# EAGLE design skips (EAGLE 5.07)
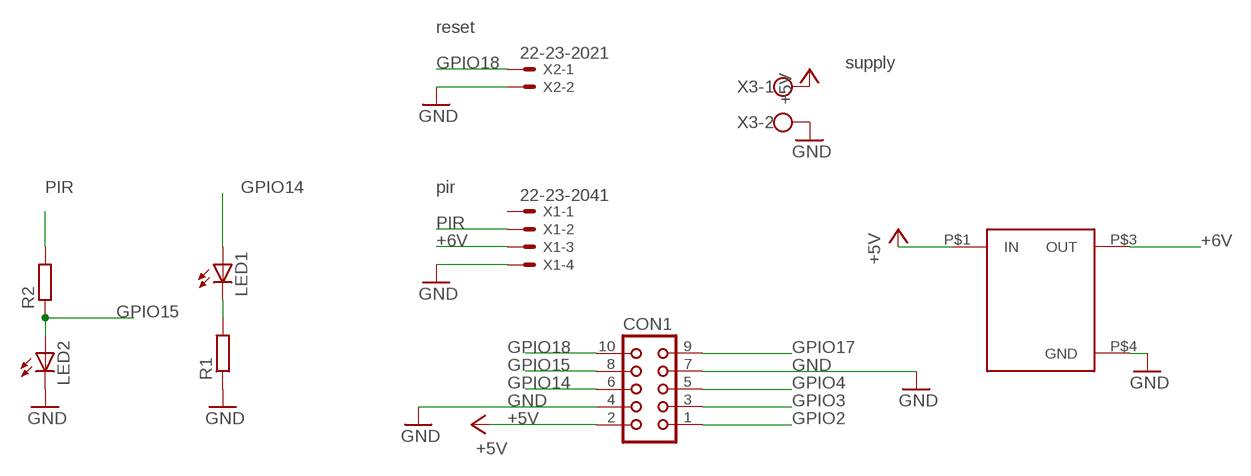
[diagram p0: schematic, sheet 1]

## Parts
CON1  CON10L  [CON10L]
LED1  LED5MM  [LED5MM]
LED2  LED5MM  [LED5MM]
R1  R-EU_0613/15  [P0613/15]
R2  R-EU_0613/15  [P0613/15]
U$1  DCBOOST  [DCBOOST]
X1  22-23-2041  [22-23-2041]
X2  22-23-2021  [22-23-2021]
X3  W237-102  [W237-102]

## Nets
+5V: CON1.2 U$1.P$1(IN) X3.1
+6V: U$1.P$3(OUT) X1.3
GND: CON1.4 CON1.7 LED2.K(C) R1.1 U$1.P$4(GND) X1.4 X2.2 X3.2
GPIO2: CON1.1
GPIO3: CON1.3
GPIO4: CON1.5
GPIO14: CON1.6 LED1.A
GPIO15: CON1.8 LED2.A R2.1
GPIO17: CON1.9
GPIO18: CON1.10 X2.1
N$2: LED1.K(C) R1.2
PIR: R2.2 X1.2
Unconnected: X1.1

## Notes on the sheet
- reset
- supply
- pir

## Library data of the parts
CON1 = con-harting:CON10L: CONNECTOR
LED1 LED2 = matt led:LED: LED OSRAM: - CHIPLED LG R971, LG N971, LY N971, LG Q971, LY Q971, LO R971, LY R971 LH N974, LH R974 LS Q976, LO Q976, LY Q976 LO Q996 - Hyper CHIPLED LW Q18S LB Q993, LB Q99A, LB R99A - SideLED LS A670, LO A670, LY A670, LG A670, LP A670 LB A673, LV A673, LT A673, LW A673 LH A674 LY A675 LS A676, LA A676, LO A676, LY A676, LW A676 LS A679, LY A679, LG A679 - Hyper Micro SIDELED® LS Y876, LA Y876, LO Y876, LY Y876 LT Y87S - SmartLED LW L88C, LW L88S LB L89C, LB L89S, LG L890 LS L89K, LO L89K, LY L89K LS L896, LA L896, LO L896, LY L896 - TOPLED LS T670, LO T670, LY T670, LG T670, LP T670 LSG T670, LSP T670, LSY T670, LOP T670, LYG T670 LG T671, LOG T671, LSG T671 LB T673, LV T673, LT T673, LW T673 LH T674 LS T676, LA T676, LO T676, LY T676, LB T676, LH T676, LSB T676, LW T676 LB T67C, LV T67C, LT T67C, LS T67K, LO T67K, LY T67K, LW E67C LS E67B, LA E67B, LO E67B, LY E67B, LB E67C, LV E67C, LT E67C LW T67C LS T679, LY T679, LG T679 LS T770, LO T770, LY T770, LG T770, LP T770 LB T773, LV T773, LT T773, LW T773 LH T774 LS E675, LA E675, LY E675, LS T675 LS T776, LA T776, LO T776, LY T776, LB T776 LHGB T686 LT T68C, LB T68C - Hyper Mini TOPLED® LB M676 - Mini TOPLED Santana® LG M470 LS M47K, LO M47K, LY M47K Source: http://www.osram.convergy.de LUXEON: - LUMILED® LXK2-PW12-R00, LXK2-PW12-S00, LXK2-PW14-U00, LXK2-PW14-V00 LXK2-PM12-R00, LXK2-PM12-S00, LXK2-PM14-U00 LXK2-PE12-Q00, LXK2-PE12-R00, LXK2-PE12-S00, LXK2-PE14-T00, LXK2-PE14-U00 LXK2-PB12-K00, LXK2-PB12-L00, LXK2-PB12-M00, LXK2-PB14-N00, LXK2-PB14-P00, LXK2-PB14-Q00 LXK2-PR12-L00, LXK2-PR12-M00, LXK2-PR14-Q00, LXK2-PR14-R00 LXK2-PD12-Q00, LXK2-PD12-R00, LXK2-PD12-S00 LXK2-PH12-R00, LXK2-PH12-S00 LXK2-PL12-P00, LXK2-PL12-Q00, LXK2-PL12-R00 Source: www.luxeon.com KINGBRIGHT: KA-3528ASYC Source: www.kingbright.com
R1 R2 = matt rcl:R-EU_: RESISTOR, European symbol
U$1 = matt:DCBOOST
X1 = con-molex:22-23-2041: .100" (2.54mm) Center Header - 4 Pin
X2 = con-molex:22-23-2021: .100" (2.54mm) Center Header - 2 Pin
X3 = con-wago-500:W237-102: WAGO SCREW CLAMP

## Board
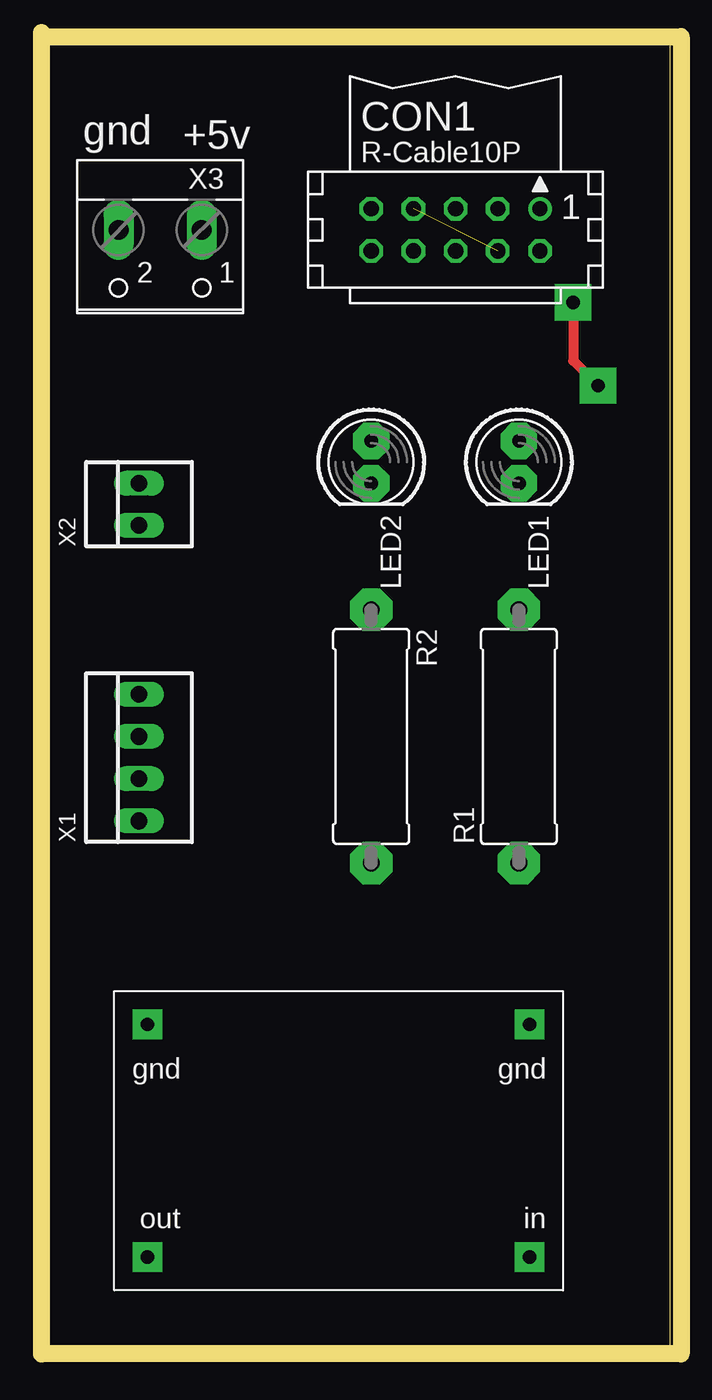
[diagram p1: board, top side]
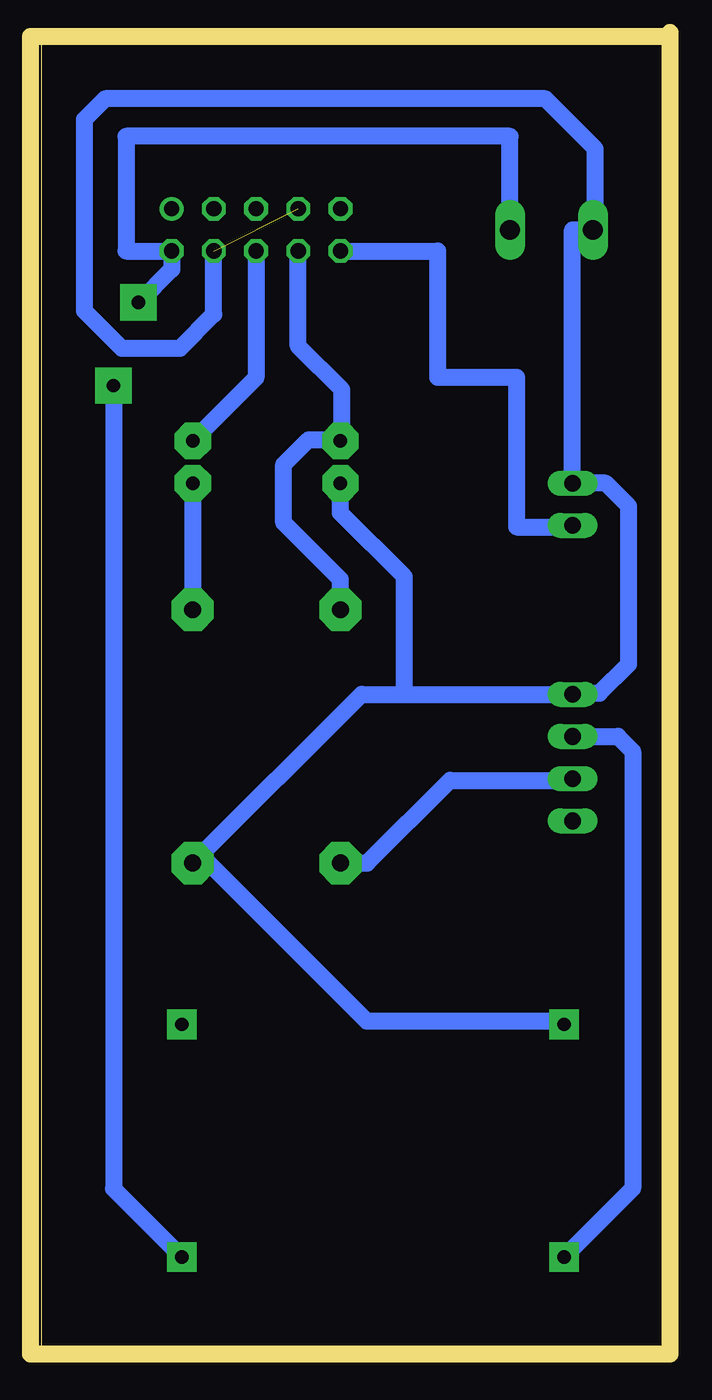
[diagram p2: board, bottom side, seen from below]

Size 37.83 x 79.2 mm. Coordinates in mm from the lower left corner, seen from the top.
Outline: 0,0 37.83,0 37.83,79.2 0,79.2 0,0
Copper layers (1*16): Top 0.035mm / dielectric 1.5mm / Bottom 0.035mm
Design rules "default": minimum track width 10mil, minimum drill 24mil, track to track 8mil, track to pad 8mil, pad to pad 8mil, via to via 8mil, smd to smd 8mil, copper to edge 40mil, drill to drill 8mil, minimum pad ring 10mil, minimum via ring 8mil, stop-mask expansion 4mil, vias tented up to drill 0mil, thermal gap 10mil
Milling: 4 lines

### Footprints (pad centres in the part's own frame; a part is rotated, then mirrored left to right if it is on the bottom)
CON10L = drill 0.914 round: 1 5.08,1.27 | drill 0.914 octagon: 2 5.08,-1.27; 3 2.54,1.27; 4 2.54,-1.27; 5 0,1.27; 6 0,-1.27; 7 -2.54,1.27; 8 -2.54,-1.27; 9 -5.08,1.27; 10 -5.08,-1.27
LED5MM = drill 0.813 pad 2.184 octagon: A -1.27,0; K 1.27,0
P0613/15 = drill 1.016 pad 2.54 octagon: 1 -7.62,0; 2 7.62,0
DCBOOST = drill 0.8 pad 1.778 square: P$1 1.89,16.08; P$2 1.89,2.08; P$3 24.89,16.08; P$4 24.89,2.08
22-23-2041 = drill 1 long: 1 -3.81,0; 2 -1.27,0; 3 1.27,0; 4 3.81,0
22-23-2021 = drill 1 long: 1 -1.27,0; 2 1.27,0
W237-102 = drill 1.194 long: 1 -2.5,-1.27; 2 2.5,-1.27

### Placement (x,y rotation side)
CON1  24.92,67.87 0 top
LED1  28.73,53.9 270 top
LED2  19.84,53.9 270 top
R1  28.73,37.39 90 top
R2  19.84,37.39 270 top
U$1  31.27,22.15 180 top
X1  5.87,36.12 90 top
X2  5.87,51.36 90 top
X3  7.14,66.6 180 top

### Tracks (layer width: path | path; a pad name or v marks a point on that pad's centre or on a via)
+5V  (via drill 0.8 pad 2.18)
  Top 0.61: v32,63.5 32,60 v33.5,58.5
  Bottom 1.016: X3.1 9.64,73.5 32.75,73.5 32.75,66.6 CON1.2 30,65.5 v32,63.5 | v33.5,58.5 33.5,10.19 U$1.P$1
+6V
  Bottom 1.016: X1.3 3.14,37.39 2.25,36.5 2.25,10.2 U$1.P$3
GND  (1 unrouted)
  Bottom 0.61: X3.2 4.5,68.01 | 27.77,29.77 R1.1 | U$1.P$4 6.56,20.25 | 16.25,39.93 16,40.18 | X1.4 5.8,40
  Bottom 1.016: X3.2 5.87,67.87 X2.2 3.88,52.63 2.5,51.25 2.5,41.75 4.25,40 5.8,40 | 4.5,68.01 4.5,72.75 7.5,75.75 34,75.75 35.25,74.5 35.25,63 33,60.75 29.5,60.75 27.46,62.79 CON1.4 | 27.77,29.77 18.25,20.25 6.56,20.25 | X1.4 16.25,39.93 18.57,39.93 R1.1 | LED2.K 19.84,50.84 16,47 16,40.18
GPIO14
  Bottom 1.016: CON1.6 24.92,58.98 LED1.A
GPIO15
  Bottom 0.61: 19.75,55.26 LED2.A 19.92,55.25
  Bottom 1.016: CON1.8 22.38,60.88 19.75,58.25 19.75,55.26 | R2.1 19.84,46.84 23.25,50.25 23.25,53.75 21.75,55.25 19.92,55.25
GPIO18
  Bottom 0.61: 5.87,50 X2.1
  Bottom 1.016: CON1.10 14,66.6 14,59 9.25,59 9.25,50 5.87,50
N$2
  Bottom 1.016: LED1.K R1.2
PIR
  Bottom 0.61: 5.75,34.75 5.5,34.5 5.52,34.5 X1.2
  Bottom 1.016: R2.2 18.23,29.77 13.25,34.75 5.75,34.75

### Text on the board
tNames: gnd | +5v